# Altium schematic sheet Mainboard_ThermistorAmp.SchDoc
size A
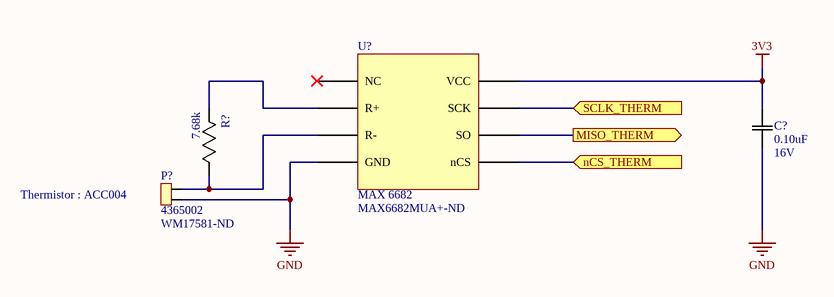
[diagram p0: Mainboard_ThermistorAmp.SchDoc]

## Parts
C?  Rating: 16V  [0603]  (hidden comment: 0.10uF)
P?  4365002  Supplier Part Number 2: WM17581-ND  [43650-02]
R?  7.68k  [0805]
U?  MAX 6682  Supplier Part Number 1: MAX6682MUA+-ND  [8-MSOP]

## Ports
MISO_THERM (out), nCS_THERM (in), SCLK_THERM (in)

## Nets
3V3: C?.1(C1) U?.8(VCC)
GND: C?.2(C2) P?.1 U?.4(GND)
MISO_THERM: U?.6(SO) ; port MISO_THERM
nCS_THERM: U?.5(nCS) ; port nCS_THERM
SCLK_THERM: U?.7(SCK) ; port SCLK_THERM
NetP?_2: P?.2 R?.1(R1) U?.3(R-)
NetR?_2: R?.2(R2) U?.2(R+)

Not connected (* = marked no-connect by the designer): U? 1(NC)*

## Notes on the sheet
- (near P?) Thermistor : ACC004

## Library data of the parts
C? = CAP 0.10uF 16V: CAP CER 0.10UF 16V X5R 0603/0805; Tolerance: 10%; Package: 0603/0805; Temperature Coefficient: X5R; Operating Temperature: -55°C ~ 85°C; Value: 0.10uF
P? = CN MOLEX 4365002XX: MOLEX MICROFIT 2CKT RIGHT THRU; MF: MOLEX; MP: 4365002XX; Digikey: WM17581-ND; Digikey Link: https://www.digikey.com/en/products/detail/molex/0436500205/3310532?s=N4IgTCBcDaICwGYBsBWADGsaUgLoF8g; Package: Microfit; Price: 1.44 CAD; Value: N/A; Supplier 1: Digi-Key
R? = RES 7.68k 0.15W: RES SMD 7.68K OHM 0.1% 0.15W 0805; Power (Watts): 0.125W; Tolerance: 5%; Package: 0805; Value: 7.68k
U? = MAX 6682: MAX 6685 Thermistor - SPI converter, 8bit; Supplier 1: Digi-Key